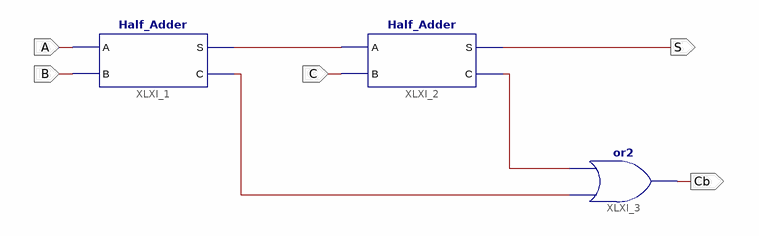
[diagram p0: schematic sheet 1]
// Xilinx ISE schematic Full_Adder.sch (spartan3e) as structural Verilog: 3 symbols, 5 ports
module Full_Adder (
  input  A,
  input  B,
  input  C,
  output S,
  output Cb
);

  wire XLXN_1, XLXN_2, XLXN_3;

  Half_Adder XLXI_1 (.A(A), .B(B), .S(XLXN_3), .C(XLXN_1));
  Half_Adder XLXI_2 (.A(XLXN_3), .B(C), .S(S), .C(XLXN_2));
  or XLXI_3 (Cb, XLXN_1, XLXN_2);
endmodule
